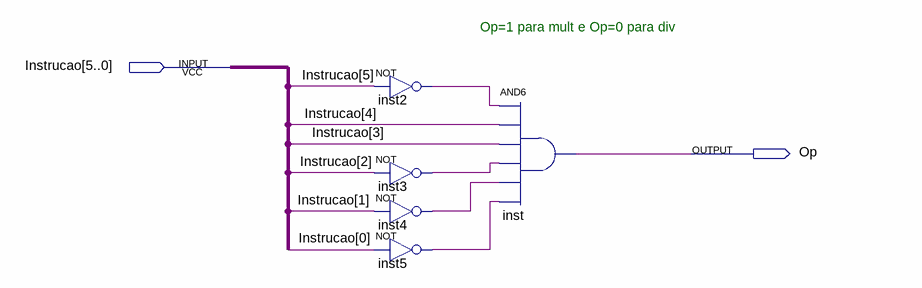
[diagram p0: schematic sheet]
// Quartus schematic Coprocessador_controle.bdf as structural Verilog: 5 symbols, 2 pins
module Coprocessador_controle (
  input  [5:0] Instrucao,
  output Op
);

  wire inst2_out, inst3_out, inst4_out, inst5_out;

  not inst2 (inst2_out, Instrucao[5]);
  not inst3 (inst3_out, Instrucao[2]);
  not inst4 (inst4_out, Instrucao[1]);
  not inst5 (inst5_out, Instrucao[0]);
  and inst (Op, inst2_out, Instrucao[4], Instrucao[3], inst3_out, inst4_out, inst5_out);

  // Notes on the sheet:
  //   Op=1 para mult e Op=0 para div
endmodule
